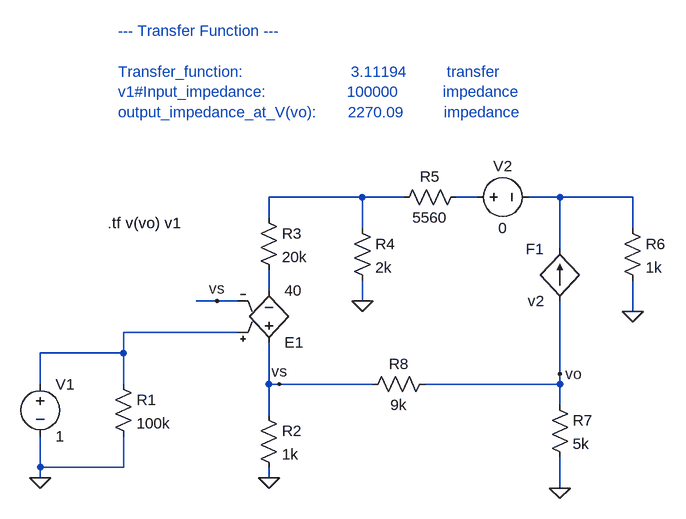
[diagram p0: schematic g1_9.asc]
g1_9.asc, the LTspice schematic file:
Version 4
SHEET 1 996 680
WIRE 464 -112 320 -112
WIRE 528 -112 464 -112
WIRE 640 -112 608 -112
WIRE 768 -112 720 -112
WIRE 880 -112 768 -112
WIRE 320 -80 320 -112
WIRE 464 -64 464 -112
WIRE 880 -64 880 -112
WIRE 768 -32 768 -112
WIRE 320 32 320 0
WIRE 240 48 208 48
WIRE 272 48 240 48
WIRE 464 48 464 16
WIRE 880 64 880 16
WIRE 272 96 96 96
WIRE 96 128 96 96
WIRE 96 128 -32 128
WIRE 768 160 768 48
WIRE -32 176 -32 128
WIRE 96 176 96 128
WIRE 320 176 320 112
WIRE 336 176 320 176
WIRE 480 176 336 176
WIRE 768 176 768 160
WIRE 768 176 560 176
WIRE 768 208 768 176
WIRE 320 224 320 176
WIRE -32 304 -32 256
WIRE 96 304 96 256
WIRE 96 304 -32 304
WIRE -32 320 -32 304
WIRE 320 320 320 304
WIRE 768 336 768 288
FLAG -32 320 0
FLAG 320 320 0
FLAG 464 48 0
FLAG 880 64 0
FLAG 768 336 0
FLAG 768 160 vo
FLAG 336 176 vs
FLAG 240 48 vs
SYMBOL voltage -32 160 R0
WINDOW 123 0 0 Left 2
WINDOW 39 0 0 Left 2
SYMATTR InstName V1
SYMATTR Value 1
SYMBOL res 80 160 R0
SYMATTR InstName R1
SYMATTR Value 100k
SYMBOL res 304 208 R0
SYMATTR InstName R2
SYMATTR Value 1k
SYMBOL res 448 -80 R0
SYMATTR InstName R4
SYMATTR Value 2k
SYMBOL res 624 -128 R90
WINDOW 0 0 56 VBottom 2
WINDOW 3 32 56 VTop 2
SYMATTR InstName R5
SYMATTR Value 5560
SYMBOL res 864 -80 R0
SYMATTR InstName R6
SYMATTR Value 1k
SYMBOL res 752 192 R0
SYMATTR InstName R7
SYMATTR Value 5k
SYMBOL res 576 160 R90
WINDOW 0 0 56 VBottom 2
WINDOW 3 32 56 VTop 2
SYMATTR InstName R8
SYMATTR Value 9k
SYMBOL res 304 -96 R0
SYMATTR InstName R3
SYMATTR Value 20k
SYMBOL voltage 624 -112 R270
WINDOW 0 32 56 VTop 2
WINDOW 3 -32 56 VBottom 2
WINDOW 123 -2 56 VTop 2
WINDOW 39 0 0 Left 2
SYMATTR InstName V2
SYMATTR Value 0
SYMBOL f 768 48 R180
WINDOW 0 24 80 Left 2
WINDOW 3 24 0 Left 2
SYMATTR InstName F1
SYMATTR Value v2
SYMATTR Value2 200
SYMBOL e 320 128 M180
SYMATTR InstName E1
SYMATTR Value 40
TEXT 72 -72 Left 2 !.tf v(vo) v1
TEXT 88 -368 Left 2 ;--- Transfer Function ---\n \nTransfer_function:                        3.11194         transfer\nv1#Input_impedance:                  100000          impedance\noutput_impedance_at_V(vo):       2270.09         impedance

The netlist it stands for:
* g1_9.asc
V1 N005 0 1
R1 N005 0 100k
R2 vs 0 1k
R4 N001 0 2k
R5 N002 N001 5560
R6 N003 0 1k
R7 vo 0 5k
R8 vo vs 9k
R3 N001 N004 20k
V2 N002 N003 0
F1 vo N003 v2 200
E1 vs N004 N005 vs 40
.tf v(vo) v1
* --- Transfer Function ---
* Transfer_function:                        3.11194         transfer
* v1#Input_impedance:                  100000          impedance
* output_impedance_at_V(vo):       2270.09         impedance
.backanno
.end